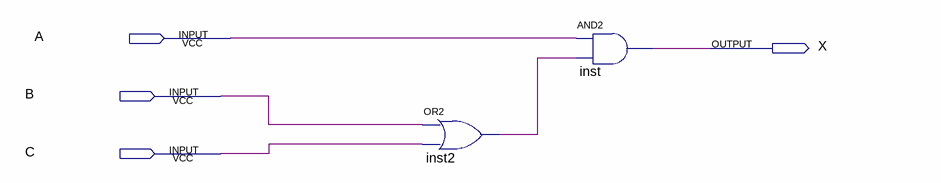
[diagram p0: schematic sheet]
// Quartus schematic Bloque.bdf as structural Verilog: 2 symbols, 4 pins
module Bloque (
  input  A,
  input  B,
  input  C,
  output X
);

  wire inst2_out;

  or inst2 (inst2_out, B, C);
  and inst (X, A, inst2_out);
endmodule
